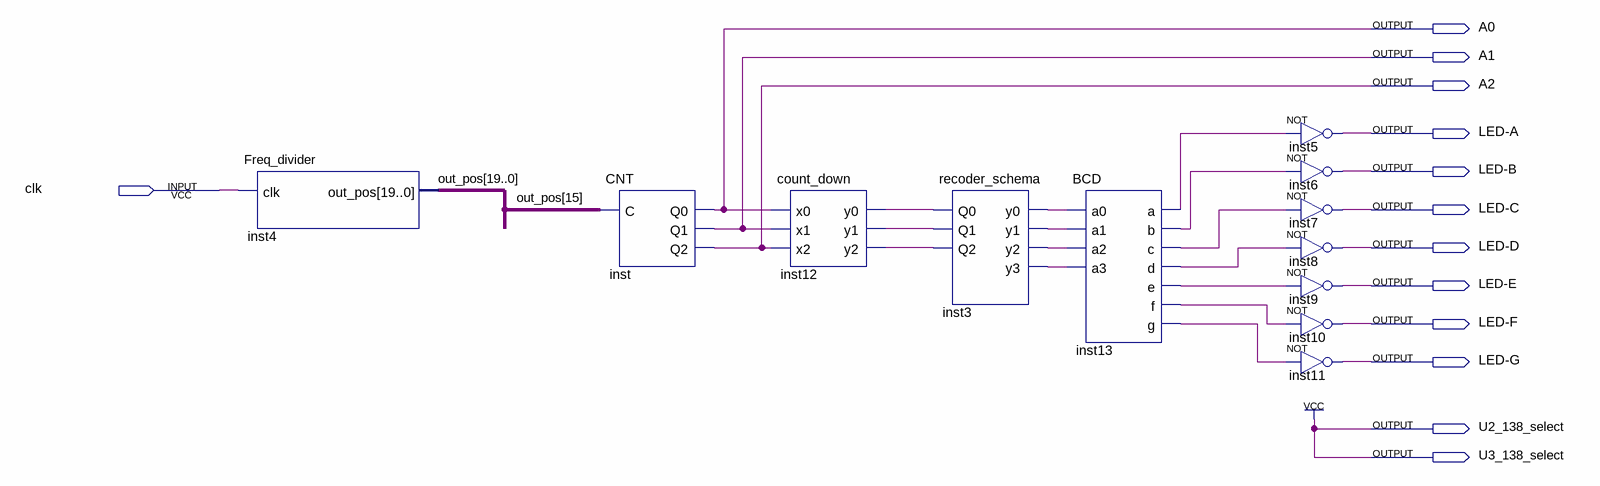
[diagram p0: schematic sheet]
// Quartus schematic main.bdf as structural Verilog: 12 symbols, 13 pins
module main (
  input  clk,
  output A0,
  output A1,
  output A2,
  output \LED-A ,
  output \LED-B ,
  output \LED-C ,
  output \LED-D ,
  output \LED-E ,
  output \LED-F ,
  output \LED-G ,
  output U2_138_select,
  output U3_138_select
);

  wire inst3_y0, inst3_y1, inst3_y2, inst3_y3, inst12_y0, inst12_y1, inst12_y2, inst13_a, inst13_b, inst13_c,
       inst13_d, inst13_e, inst13_f, inst13_g;
  wire [19:0] out_pos;

  Freq_divider inst4 (.clk(clk), .out_pos(out_pos));
  CNT inst (.C(out_pos[15]), .Q0(A0), .Q1(A1), .Q2(A2));
  count_down inst12 (.x0(A0), .x1(A1), .x2(A2), .y0(inst12_y0), .y1(inst12_y1), .y2(inst12_y2));
  recoder_schema inst3 (
    .Q0(inst12_y0), .Q1(inst12_y1), .Q2(inst12_y2), .y0(inst3_y0), .y1(inst3_y1), .y2(inst3_y2), .y3(inst3_y3));
  BCD inst13 (
    .a0(inst3_y0), .a1(inst3_y1), .a2(inst3_y2), .a3(inst3_y3), .a(inst13_a), .b(inst13_b), .c(inst13_c),
    .d(inst13_d), .e(inst13_e), .f(inst13_f), .g(inst13_g));
  not inst5 (\LED-A , inst13_a);
  not inst6 (\LED-B , inst13_b);
  not inst7 (\LED-C , inst13_c);
  not inst8 (\LED-D , inst13_d);
  not inst9 (\LED-E , inst13_e);
  not inst10 (\LED-F , inst13_f);
  not inst11 (\LED-G , inst13_g);

  assign U2_138_select = 1'b1;
  assign U3_138_select = 1'b1;
endmodule
